# EAGLE design preamp (EAGLE 7.3.0)
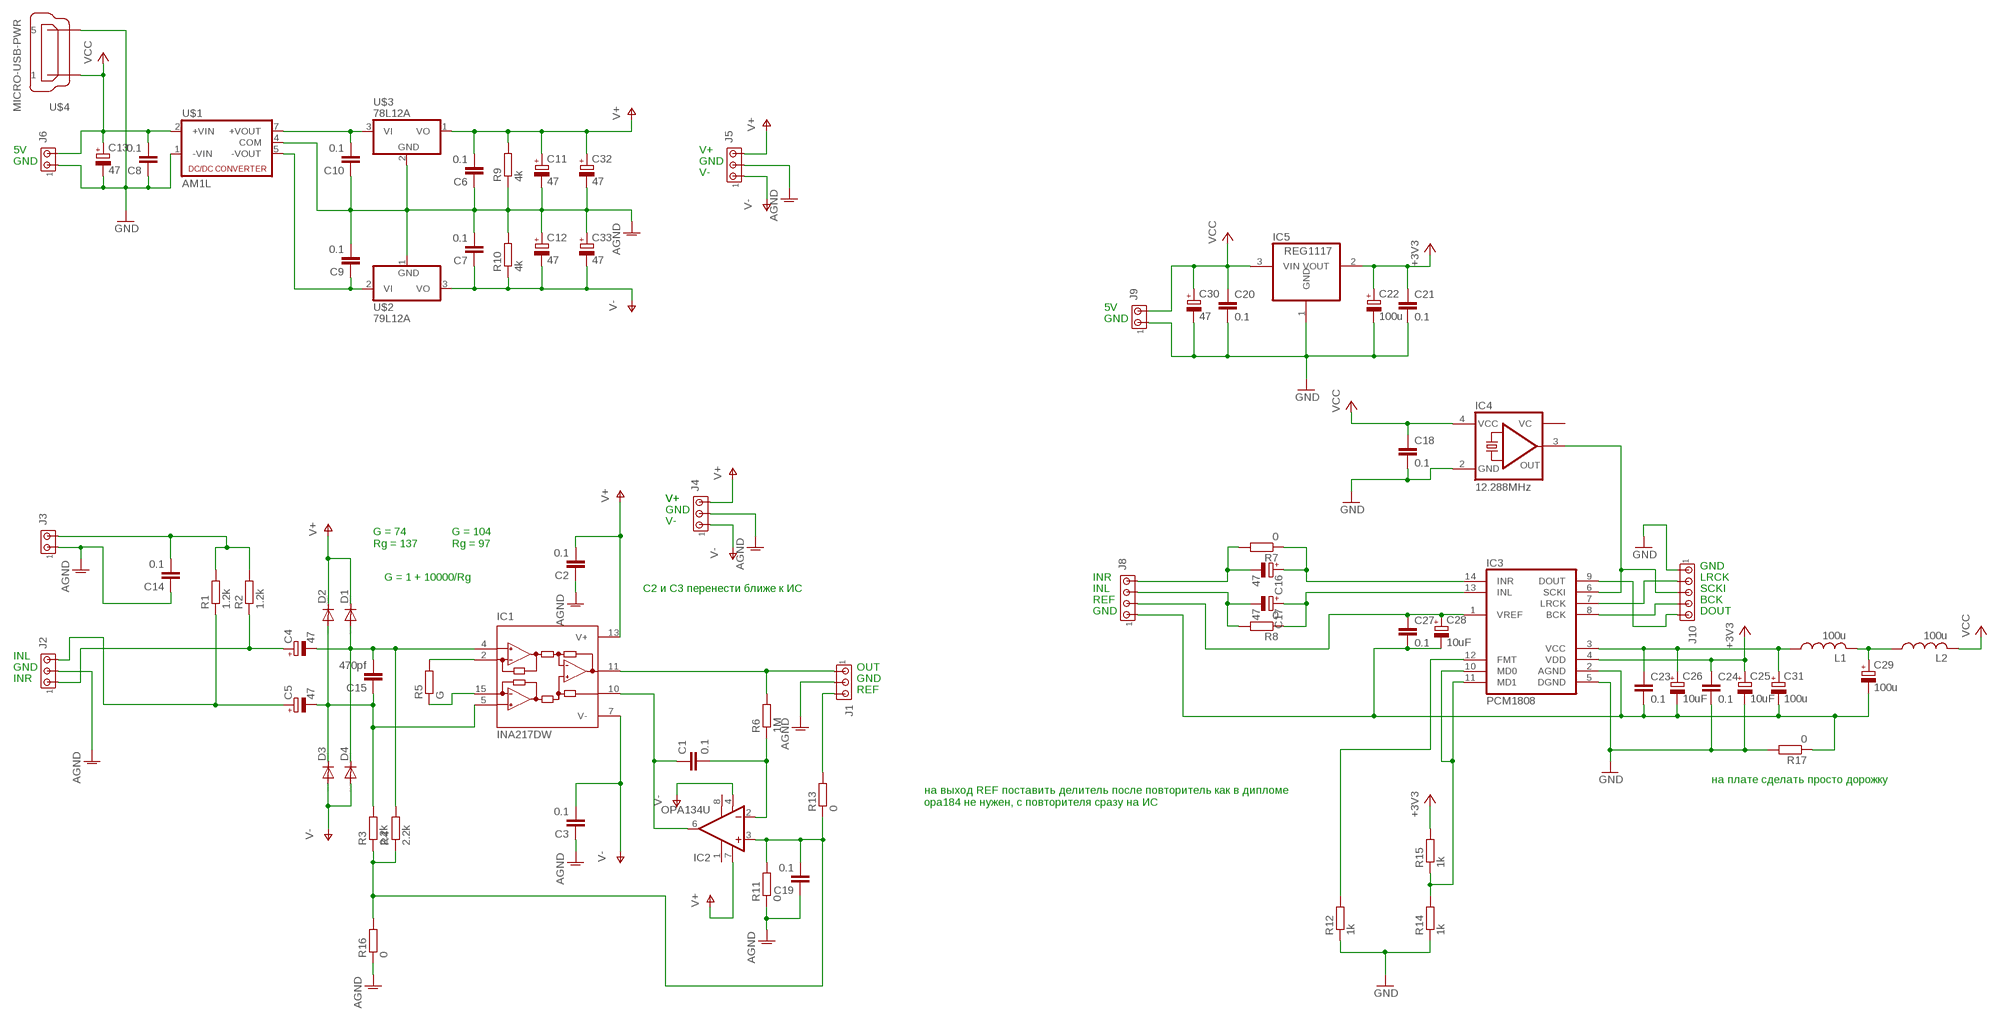
[diagram p0: schematic, sheet 1]

## Parts
C1  0.1  C-EUC0805  [C0805]
C2  0.1  C-EUC0805  [C0805]
C3  0.1  C-EUC0805  [C0805]
C4  47  CPOL-EU153CLV-0605  [153CLV-0605]
C5  47  CPOL-EU153CLV-0605  [153CLV-0605]
C6  0.1  C-EUC0805  [C0805]
C7  0.1  C-EUC0805  [C0805]
C8  0.1  C-EUC0805  [C0805]
C9  0.1  C-EUC0805  [C0805]
C10  0.1  C-EUC0805  [C0805]
C11  47  CPOL-EU153CLV-0605  [153CLV-0605]
C12  47  CPOL-EU153CLV-0605  [153CLV-0605]
C13  47  CPOL-EU153CLV-0605  [153CLV-0605]
C14  0.1  C-EUC0805  [C0805]
C15  470pf  C-EUC0805  [C0805]
C16  47  CPOL-EU153CLV-0605  [153CLV-0605]
C17  47  CPOL-EU153CLV-0605  [153CLV-0605]
C18  0.1  C-EUC0805  [C0805]
C19  0.1  C-EUC0805  [C0805]
C20  0.1  C-EUC0805  [C0805]
C21  0.1  C-EUC0805  [C0805]
C22  100u  CPOL-EU153CLV-0605  [153CLV-0605]
C23  0.1  C-EUC0805  [C0805]
C24  0.1  C-EUC0805  [C0805]
C25  10uF  CPOL-EUSMCA  [SMC_A]
C26  10uF  CPOL-EUSMCA  [SMC_A]
C27  0.1  C-EUC0805  [C0805]
C28  10uF  CPOL-EUSMCA  [SMC_A]
C29  100u  CPOL-EU153CLV-0605  [153CLV-0605]
C30  47  CPOL-EU153CLV-0605  [153CLV-0605]
C31  100u  CPOL-EU153CLV-0605  [153CLV-0605]
C32  47  CPOL-EU153CLV-0605  [153CLV-0605]
C33  47  CPOL-EU153CLV-0605  [153CLV-0605]
D1  DIODE-SOD123  [SOD123]
D2  DIODE-SOD123  [SOD123]
D3  DIODE-SOD123  [SOD123]
D4  DIODE-SOD123  [SOD123]
IC1  INA217DW  [DW_RPDSO-G16]
IC2  OPA134U  [SO08]
IC3  PCM1808  [TSSOP14]
IC4  12.288MHz  KXO-97  [KXO-97]
IC5  REG1117  [SOT223]
J1  MTA03-100  [10X03MTA]
J2  MTA03-100  [10X03MTA]
J3  MTA02-100  [10X02MTA]
J4  MTA03-100  [10X03MTA]
J5  MTA03-100  [10X03MTA]
J6  MTA02-100  [10X02MTA]
J8  MTA04-100  [10X04MTA]
J9  MTA02-100  [10X02MTA]
J10  MTA05-100  [10X05MTA]
L1  100u  L-USL3225M  [L3225M]
L2  100u  L-USL3225M  [L3225M]
R1  1.2k  R-EU_R0805  [R0805]
R2  1.2k  R-EU_R0805  [R0805]
R3  2.2k  R-EU_R0805  [R0805]
R4  2.2k  R-EU_R0805  [R0805]
R5  G  R-EU_R0805  [R0805]
R6  1M  R-EU_R0805  [R0805]
R7  0  R-EU_R0805  [R0805]
R8  0  R-EU_R0805  [R0805]
R9  4k  R-EU_R0805  [R0805]
R10  4k  R-EU_R0805  [R0805]
R11  0  R-EU_R0805  [R0805]
R12  1k  R-EU_R0805  [R0805]
R13  0  R-EU_R0805  [R0805]
R14  1k  R-EU_R0805  [R0805]
R15  1k  R-EU_R0805  [R0805]
R16  0  R-EU_R0805  [R0805]
R17  0  R-EU_R0805  [R0805]
U$1  AM1L  [SO20]
U$2  79L12A  [SOT89]
U$3  78L12A  [SOT89]
U$4  MICRO-USB-PWR  [MICRO-USB]

## Nets
+3V3: C21.1 C22.+ C24.1 C25.+ IC3.4(VDD) IC5.2(VOUT) R15.2
AGND: C2.1 C3.1 C6.1 C7.2 C9.2 C10.1 C11.- C12.+ C14.1 C19.1 C32.- C33.+ J1.2 J2.2 J3.1 J4.2 J5.2 R9.1 R10.2 R11.1 R16.1 U$1.4(COM) U$2.1(GND) U$3.2(GND)
AGND2: C23.2 C26.- C27.2 C28.- C29.- C31.- IC3.2(AGND) J8.1 R17.1
GND: C8.1 C13.- C18.2 C20.2 C21.2 C22.- C24.2 C25.- C30.- IC3.5(DGND) IC4.2(GND) IC5.1(GND) J6.1 J9.1 J10.1 R12.1 R14.1 R17.2 U$1.1(-VIN) U$4.5
N$1: IC1.2(RG1) R5.2
N$2: IC1.15(RG2) R5.1
N$3: C5.- C15.1 D2.A D3.C IC1.5(+IN) R3.2
N$4: C4.- C15.2 D1.A D4.C IC1.4(-IN) R4.2
N$5: C4.+ J2.1 R2.1
N$6: C5.+ J2.3 R1.1
N$7: C10.2 U$1.7(+VOUT) U$3.3(VI)
N$8: IC3.6(SCKI) IC4.3(OUT) J10.3
N$9: IC3.9(DOUT) J10.5
N$10: C29.+ L1.2 L2.1
N$11: C14.2 J3.2 R1.2 R2.2
N$12: C1.2 IC2.2(-IN) R6.1
N$13: IC1.11(OUT) J1.1 R6.2
N$14: C1.1 IC1.10(REF) IC2.6(OUT)
N$16: C9.1 U$1.5(-VOUT) U$2.2(VI)
N$17: IC3.12(FMT) R12.2
N$18: IC3.7(LRCK) J10.2
N$19: IC3.8(BCK) J10.4
N$20: C27.1 C28.+ IC3.1(VREF) J8.2
N$22: C16.- J8.4 R7.2
N$23: C17.- J8.3 R8.2
N$24: C17.+ IC3.13(INL) R8.1
N$25: C16.+ IC3.14(INR) R7.1
N$26: IC3.10(MD0) IC3.11(MD1) R14.2 R15.1
N$27: C23.1 C26.+ C31.+ IC3.3(VCC) L1.1
N$28: J1.3 R13.2
N$29: C19.2 IC2.3(+IN) R3.1 R4.1 R11.2 R13.1 R16.2
V+: C2.2 C6.2 C11.+ C32.+ D1.C D2.C IC1.13(V+) IC2.7(V+) J4.3 J5.3 R9.2 U$3.1(VO)
V-: C3.2 C7.1 C12.- C33.- D3.A D4.A IC1.7(V-) IC2.4(V-) J4.1 J5.1 R10.1 U$2.3(VO)
VCC: C8.2 C13.+ C18.1 C20.1 C30.+ IC4.4(VCC) IC5.3(VIN) J6.2 J9.2 L2.2 U$1.2(+VIN) U$4.1
Unconnected: IC2.1(TRIM1) IC2.8(TRIM2) IC4.1(VC)

## Notes on the sheet
- 5V | V+
- GND | GND
- V-
- 5V
- GND
- V+ | V+
- GND
- V-
- G = 74
  Rg = 137
- G = 104
  Rg = 97
- GND
- G = 1 + 10000/Rg | INR | LRCK
- С2 и С3 перенести ближе к ИС | INL | SCKI
- REF | BCK
- GND | DOUT
- INL
- GND | OUT
- INR | GND
- REF
- на плате сделать просто дорожку
- на выход REF поставить делитель после повторитель как в дипломе
  opa184 не нужен, с повторителя сразу на ИС

## Library data of the parts
C1-C3 C6-C10 C14 C15 C18-C21 C23 C24 C27 = rcl:C-EU: CAPACITOR, European symbol
C4 C5 C11-C13 C16 C17 C22 C25 C26 C28-C33 = rcl:CPOL-EU: POLARIZED CAPACITOR, European symbol
D1-D4 = diode:DIODE-: DIODE
IC1 = burr-brown:INA217: Low-Noise, Low-Distortion INSTRUMENTATION AMPLIFIER Replacement for SSM2017 Source: http://focus.ti.com/lit/ds/symlink/ina217.pdf; MF: TEXAS INSTRUMENTS; MPN: INA217AIDWT; OC_FARNELL: 1459470; OC_NEWARK: 02E2758
IC2 = burr-brown:OPA134: Operational Amplifiers SoundPlus(TM) High Performance Audio; MF: TEXAS INSTRUMENTS; MPN: OPA134UA; OC_FARNELL: 1097514; OC_NEWARK: 80K6009
IC3 = rpiadc:PCM1808
IC4 = rpiadc:KXO-97
IC5 = burr-brown:REG1117: 800mA and 1A Low Dropout (LDO) Positive Regulator 1.8V, 2.5V, 2.85V, 3.3V, 5V, and Adj; MPN: REG1117; OC_FARNELL: 1097566; OC_NEWARK: 14P6981
J1 J2 J4 J5 = con-amp:MTA03-100: AMP connector
J3 J6 J9 = con-amp:MTA02-100: AMP connector
J8 = con-amp:MTA04-100: AMP connector
J10 = con-amp:MTA05-100: AMP connector
L1 L2 = rcl:L-US: INDUCTOR, American symbol
R1-R17 = rcl:R-EU_: RESISTOR, European symbol
U$1 = rpiadc:AM1L
U$2 = rpiadc:79L12A
U$3 = rpiadc:78L12A
U$4 = rpiadc:MICRO-USB-PWR

## Board
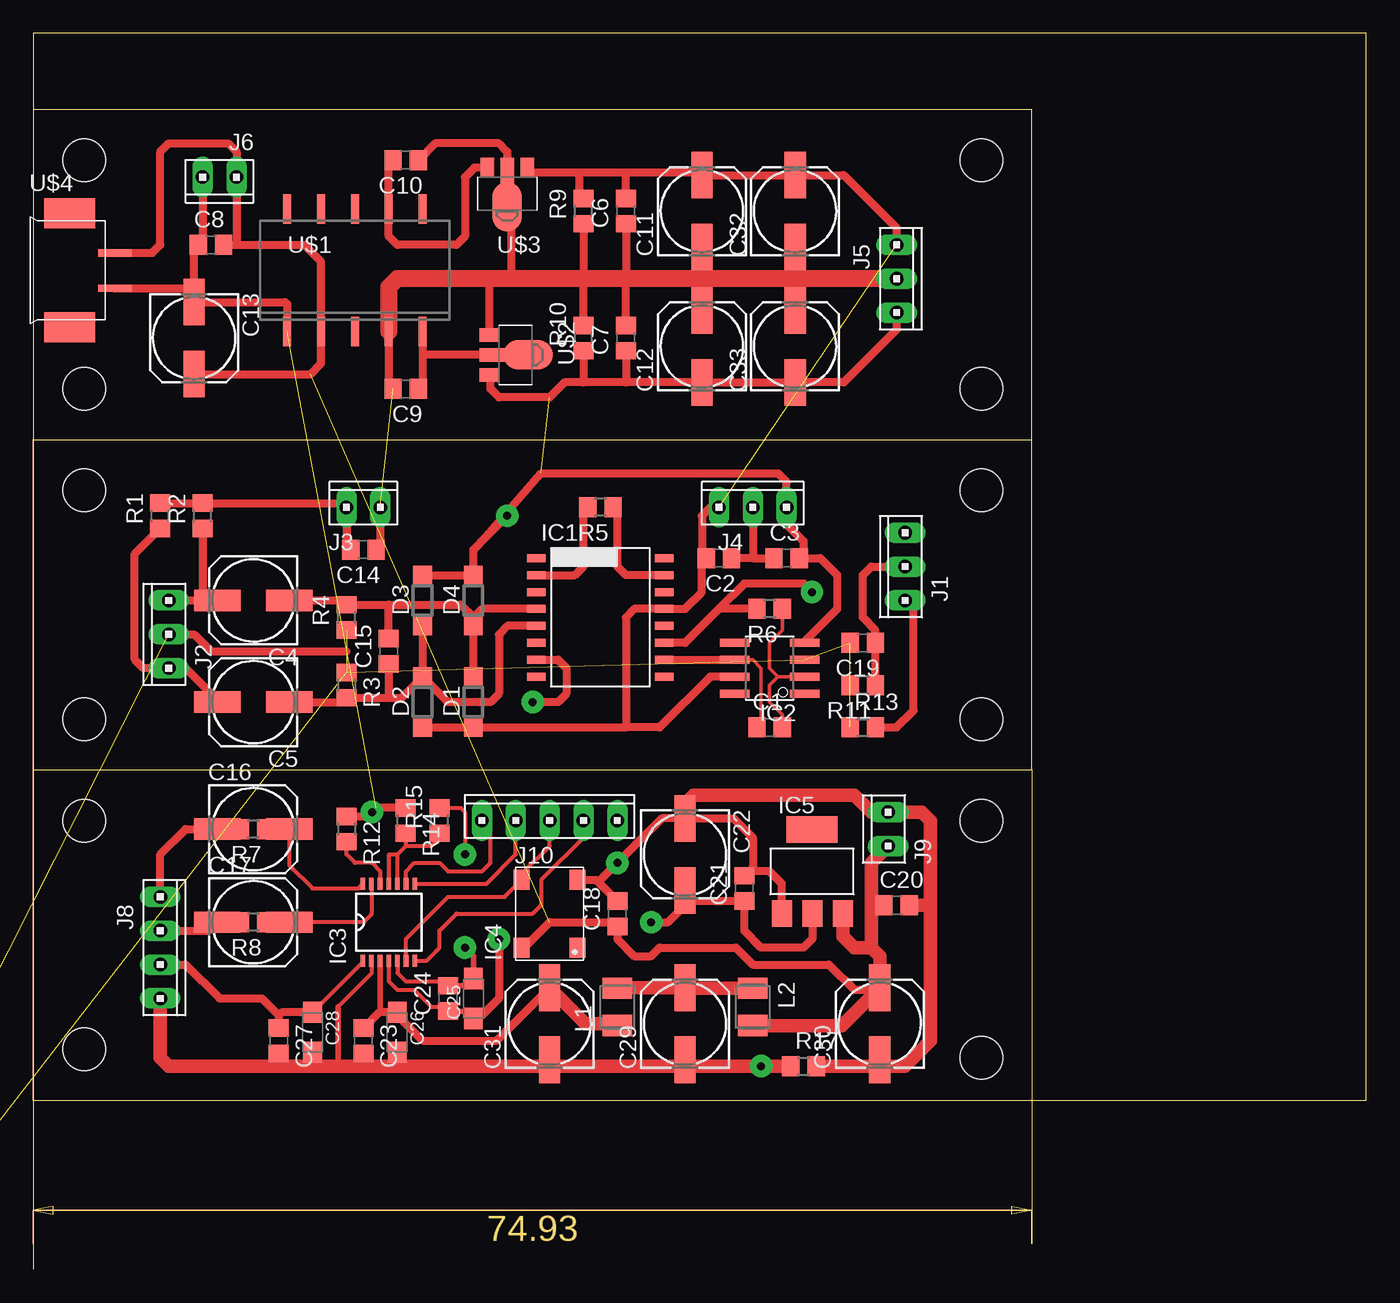
[diagram p1: board, top side]
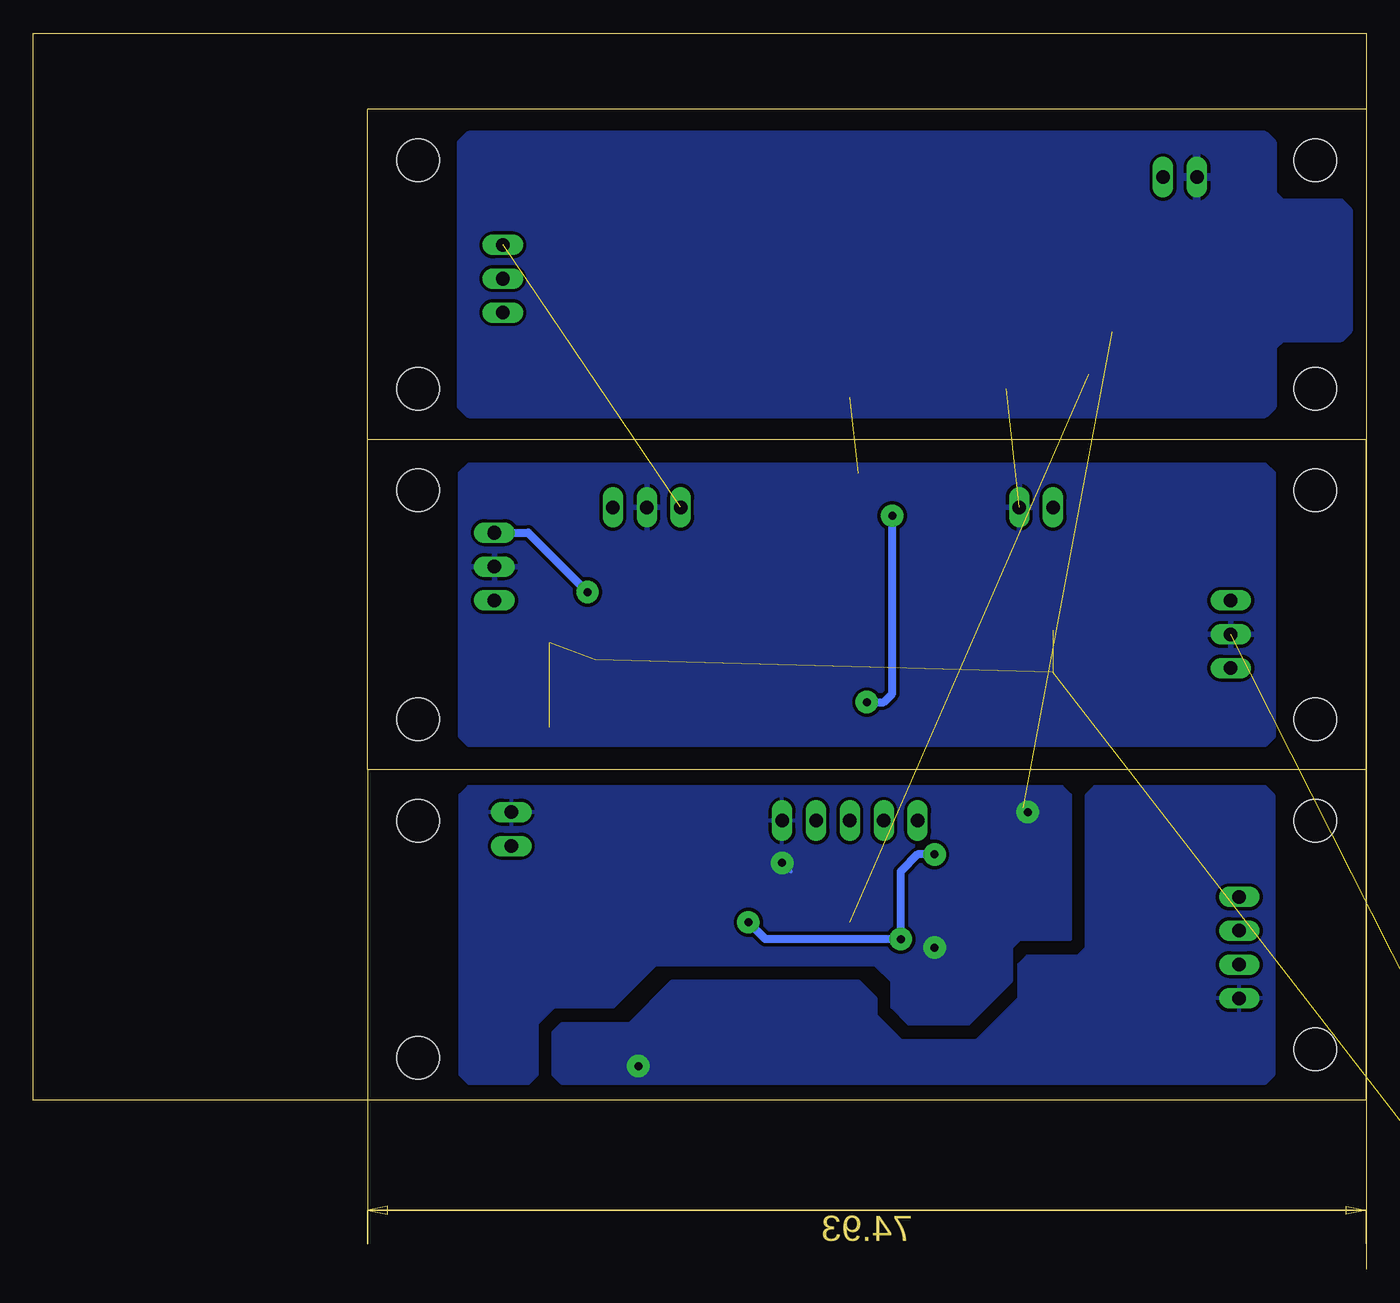
[diagram p2: board, bottom side, seen from below]

Size 100 x 92.7 mm. Coordinates in mm from the lower left corner, seen from the top.
Outline: 0,12.7 100,12.7 100,92.7 0,92.7 0,87
Outline: 0,87 0,62.23
Outline: 0,62.23 0,37.47
Outline: 0,37.47 0,12.7
Outline: 0,37.47 74.93,37.47
Outline: 74.93,37.47 74.93,1.9
Outline: 74.93,37.47 74.93,62.23
Outline: 74.93,62.23 74.93,87 0,87
Outline: 0,62.23 74.93,62.23
Outline: 0,12.7 0,0
Copper layers (1*16): Top 0.035mm / dielectric 1.5mm / Bottom 0.035mm
Design rules "default *": minimum track width 8mil, minimum drill 12mil, track to track 10mil, track to pad 10mil, pad to pad 10mil, via to via 10mil, smd to smd 10mil, copper to edge 40mil, drill to drill 8mil, minimum pad ring 10mil, minimum via ring 8mil, stop-mask expansion 4mil, vias tented up to drill 0mil, thermal gap 10mil
Holes 3.2 mm at 3.81,33.66 3.81,16.51 71.12,15.88 71.12,33.66 3.81,41.27 3.81,58.42 71.12,41.27 71.12,58.42 3.81,66.04 71.12,66.04 3.81,83.19 71.12,83.19

### Footprints (pad centres in the part's own frame; a part is rotated, then mirrored left to right if it is on the bottom)
C0805 = smd 1.3 x 1.5: 1 -0.95,0; 2 0.95,0
153CLV-0605 = smd 3.5 x 1.6: + 2.7,0; - -2.7,0
SMC_A = smd 1.6 x 1.4: + -1.5,0; - 1.5,0
SOD123 = smd 1.4 x 1.4: A 1.9,0; C -1.9,0
DW_RPDSO-G16 = smd 0.6 x 1.4: 1 -4.445,-4.8; 2 -3.175,-4.8; 3 -1.905,-4.8; 4 -0.635,-4.8; 5 0.635,-4.8; 6 1.905,-4.8; 7 3.175,-4.8; 8 4.445,-4.8; 9 4.445,4.8; 10 3.175,4.8; 11 1.905,4.8; 12 0.635,4.8; 13 -0.635,4.8; 14 -1.905,4.8; 15 -3.175,4.8; 16 -4.445,4.8
SO08 = smd 0.61 x 2.21: 1 -1.905,-2.616; 2 -0.635,-2.616; 3 0.635,-2.616; 4 1.905,-2.616; 5 1.905,2.616; 6 0.635,2.616; 7 -0.635,2.616; 8 -1.905,2.616
TSSOP14 = smd 0.9 x 0.35: 1 -2.875,1.95; 2 -2.875,1.3; 3 -2.875,0.65; 4 -2.875,0; 5 -2.875,-0.65; 6 -2.875,-1.3; 7 -2.875,-1.95; 8 2.875,-1.95; 9 2.875,-1.3; 10 2.875,-0.65; 11 2.875,0; 12 2.875,0.65; 13 2.875,1.3; 14 2.875,1.95
KXO-97 = smd 1.5 x 1.2: 1 -2.54,-2.1; 2 2.54,-2.1; 3 2.54,2.1; 4 -2.54,2.1
SOT223 = smd 1.499 x 2.007: 1 -2.261,-3.15; 2 0.025,-3.15; 3 2.311,-3.15 | smd 3.81 x 2.007: 4 0,3.15
10X03MTA = drill 1.016 long: 1 2.54,0; 2 0,0; 3 -2.54,0
10X02MTA = drill 1.016 long: 1 1.27,0; 2 -1.27,0
10X04MTA = drill 1.016 long: 1 3.81,0; 2 1.27,0; 3 -1.27,0; 4 -3.81,0
10X05MTA = drill 1.016 long: 1 5.08,0; 2 2.54,0; 3 0,0; 4 -2.54,0; 5 -5.08,0
L3225M = smd 1.6 x 2.2: 1 -1.4,0; 2 1.4,0
R0805 = smd 1.3 x 1.5: 1 -0.95,0; 2 0.95,0
SO20 = smd 0.6 x 2.2: 1 -5.715,-4.6; 2 -3.175,-4.6; 3 -0.635,-4.6; 4 1.905,-4.6; 5 4.445,-4.6; 6 4.445,4.6; 7 1.905,4.6; 8 -0.635,4.6; 9 -3.175,4.6; 10 -5.715,4.6
SOT89 = smd 1 x 1.5: 1 -1.499,-1.981; 3 1.499,-1.981 | smd 1 x 2: 2 0,-1.727 | smd 2.2 x 3.7: 2@1 0,0.94
MICRO-USB = smd 2.5 x 0.55: 1 2.95,1.3; 5 2.95,-1.35 | smd 3.8 x 2.25: M1 -0.45,4.275; M2 -0.45,-4.275

### Placement (x,y rotation side)
C1  55.24,40.64 0 top
C2  51.44,53.34 180 top
C3  56.52,53.34 0 top
C4  16.51,50.17 180 top
C5  16.51,42.55 180 top
C6  44.45,79.38 90 top
C7  44.45,69.85 90 top
C8  13.34,76.84 0 top
C9  27.94,66.04 180 top
C10  27.94,83.19 180 top
C11  50.16,79.38 90 top
C12  50.16,69.22 90 top
C13  12.06,69.85 270 top
C14  24.77,53.97 180 top
C15  26.67,46.36 90 top
C16  16.51,33.02 0 top
C17  16.51,26.04 0 top
C18  43.81,26.67 90 top
C19  62.23,46.99 180 top
C20  64.77,27.3 0 top
C21  53.34,28.57 90 top
C22  48.9,31.11 270 top
C23  24.77,17.14 270 top
C24  31.11,20.32 90 top
C25  33.02,20.32 90 top
C26  27.3,17.78 270 top
C27  18.41,17.14 270 top
C28  20.95,17.78 270 top
C29  48.9,18.41 90 top
C30  63.5,18.41 90 top
C31  38.73,18.41 90 top
C32  57.15,79.38 90 top
C33  57.15,69.22 90 top
D1  33.02,42.55 90 top
D2  29.21,42.55 90 top
D3  29.21,50.17 90 top
D4  33.02,50.17 90 top
IC1  42.55,48.89 270 top
IC2  55.24,45.08 90 top
IC3  26.67,26.04 90 top
IC4  38.73,26.67 90 top
IC5  58.42,29.84 0 top
J1  65.41,52.7 90 top
J2  10.16,47.62 90 top
J3  24.77,57.15 0 top
J4  53.98,57.15 0 top
J5  64.77,74.3 270 top
J6  13.97,81.92 180 top
J8  9.53,24.13 270 top
J9  64.14,33.02 90 top
J10  38.73,33.66 0 top
L1  43.81,19.68 90 top
L2  53.98,19.68 270 top
R1  9.53,56.52 90 top
R2  12.7,56.52 90 top
R3  23.5,43.81 270 top
R4  23.5,48.89 90 top
R5  42.55,57.15 180 top
R6  55.24,49.53 180 top
R7  16.51,33.02 180 top
R8  16.51,26.04 180 top
R9  41.27,79.38 90 top
R10  41.27,69.85 90 top
R11  62.23,43.81 180 top
R12  23.5,33.02 270 top
R13  62.23,40.64 0 top
R14  27.94,33.66 270 top
R15  30.48,33.66 90 top
R16  -14.61,-3.18 0 top  (outside the outline)
R17  57.78,15.24 0 top
U$1  24.77,74.93 0 top
U$2  36.2,68.58 270 top
U$3  35.56,80.64 180 top
U$4  3.17,74.93 0 top

### Tracks (layer width: path | path; a pad name or v marks a point on that pad's centre or on a via)
+3V3  (via drill 0.6 pad 1.68)
  Top 0.305: IC3.4 26.67,21.59 27.3,20.95 28.57,20.95 29.84,19.68 30.8,19.68 | IC5.2 58.45,25.42 | 49.69,27.62 C22.+ | C22.+ 48.9,27.94 49.21,27.62 | R15.2 32.07,34.61 32.38,34.29 v32.38,31.11 | C22.+ 48.9,28.57
  Top 0.406: 30.8,19.68 C24.1 32.47,19.37 C25.+ 33.25,19.05 33.66,19.05
  Top 0.61: IC5.2 58.45,24.79 57.78,24.13 54.61,24.13 53.34,25.4 C21.1 49.21,27.62 47.62,26.04 v46.35,26.04 | v34.92,24.77 34.92,20.32 33.66,19.05
  Bottom 0.61: v46.35,26.04 45.09,24.77 v34.92,24.77 34.92,29.84 33.66,31.11 v32.38,31.11
AGND  (2 unrouted)
  Top 0.406: 26.04,54.3 C14.1
  Top 0.61: 53.98,53.34 C3.1 | 23.5,46.36 13.34,46.36 12.06,47.62 J2.2 | J1.2 62.87,52.7 62.23,52.07 62.23,48.89 63.18,47.94 C19.1 R11.1 | J3.1 26.04,54.3 | J4.2 53.98,53.34 | 53.98,53.34 C2.1 | U$1.4 26.67,66.36 C9.2 | 34.21,71.04 U$2.1 34.21,74.22 34.29,74.3 | 50.01,76.84 C11.- 50.16,74.3 C12.+ | C33.+ 57.15,74.3 C32.- | R10.2 41.27,74.3 R9.1 | C7.2 44.45,74.3 C6.1 | 35.56,74.3 35.88,74.61 35.88,80.33 35.56,80.64 U$3.2 35.56,83.82 34.92,84.45 30.16,84.45 C10.1
  Top 1.27: U$1.4 26.67,73.66 27.3,74.3 34.29,74.3 35.56,74.3 41.27,74.3 44.45,74.3 50.16,74.3 57.15,74.3 J5.2
  pour Bottom: 6.99,59.69 6.99,40 7.62,39.37 67.31,39.37 67.94,40 67.94,59.69 67.31,60.33 7.62,60.33
AGND2  (via drill 0.6 pad 1.68)
  Top 0.305: 25.4,23.16 IC3.2 25.37,22.2 22.86,19.68 | C27.2 18.41,15.24 | C28.- 20.95,15.24 | C23.2 24.77,15.24 | C26.- 27.3,15.24 | C31.- 38.73,15.24 | C29.- 48.9,15.24
  Top 0.406: 22.86,19.68 22.86,15.24
  Top 1.016: J8.1 9.53,15.88 10.16,15.24 18.41,15.24 20.95,15.24 22.86,15.24 24.77,15.24 27.3,15.24 38.73,15.24 48.9,15.24 v54.61,15.24 R17.1
  pour Bottom: 20.95,24.13 20.95,35.56 20.32,36.2 7.62,36.2 6.99,35.56 6.99,14.6 7.62,13.97 60.33,13.97 60.96,14.6 60.96,17.78 60.33,18.41 55.24,18.41 52.07,21.59 38.1,21.59 36.83,20.32 36.83,19.05 34.92,17.14 29.21,17.14 26.04,20.32 26.04,22.86 25.4,23.49 21.59,23.49
GND  (via drill 0.6 pad 1.68)  (1 unrouted)
  Top 0.305: IC3.5 27.32,22.21 27.94,21.59 30.8,21.59 | 32.47,21.27 C25.- | 63.02,15.24 C30.- | 53.98,30.16 C21.2
  Top 0.406: 30.8,21.59 C24.2 32.47,21.27 | 42.23,29.21 42.55,29.21 | C25.- 33.02,23.49 v32.38,24.13
  Top 0.61: IC4.2 42.23,29.21 C18.2 | 53.98,30.16 53.98,32.38 52.55,33.81 C22.- 47.15,33.81 v43.81,30.48 42.55,29.21 | R14.1 25.71,34.61 v25.4,34.29 25.08,33.97 R12.1 | IC5.1 56.16,28.93 55.24,29.84 53.66,29.84 C21.2 | 19.05,71.12 U$1.1 19.05,72.39 18.89,72.55 C13.- | 11.67,72.94 C13.- | C13.- 12.06,73.66 | 12.06,73.66 12.06,76.52 C8.1 12.7,77.15 J6.1 | U$4.5 11.98,73.58 12.06,73.66
  Top 1.016: R17.2 63.5,15.24 | 63.5,15.24 65.41,15.24 67.31,17.14 67.31,27.3 | 67.31,27.3 67.31,33.66 66.67,34.29 J9.1 62.87,34.29 61.59,35.56 49.53,35.56 48.9,34.92 48.9,33.66 | C20.2 67.31,27.3 | C30.- 63.5,15.24
  Bottom 0.305: 43.18,29.84 v43.81,30.48
  pour Bottom: 22.23,35.56 22.23,24.77 26.04,24.77 26.67,24.13 26.67,21.59 29.84,18.41 34.29,18.41 35.56,19.68 35.56,21.59 36.83,22.86 53.34,22.86 56.52,19.68 67.94,19.68 67.94,35.56 67.31,36.2 22.86,36.2
  pour Bottom: 6.99,64.77 6.99,69.22 6.35,69.85 1.91,69.85 1.27,70.48 1.27,79.38 1.91,80.01 6.35,80.01 6.99,80.64 6.99,84.45 7.62,85.09 67.31,85.09 67.94,84.45 67.94,64.77 67.31,64.14 7.62,64.14
N$1
  Top 0.254: 41.27,56.83 R5.2
  Top 0.61: IC1.2 40.64,52.07 41.27,52.7 41.27,56.83
N$2
  Top 0.254: 43.81,56.83 R5.1
  Top 0.61: IC1.15 44.45,52.07 43.81,52.7 43.81,56.83
N$3
  Top 0.406: 23.5,42.55 R3.2
  Top 0.61: R3.2 26.67,42.86 | 26.67,42.86 27.63,42.86 D2.A | D3.C D2.A | C15.1 26.67,42.86 | C5.- 23.5,42.55 | D2.A 31.11,42.55 34.29,42.55 34.92,43.18 34.92,47.62 35.56,48.26 IC1.5
N$4
  Top 0.254: 33.02,48.89 D4.C
  Top 0.406: 23.5,50.17 R4.2
  Top 0.61: R4.2 26.67,49.84 | 26.67,49.84 32.07,49.84 33.02,48.89 33.66,49.53 IC1.4 | C15.2 26.67,49.84 | D1.A D4.C | C4.- 23.5,50.17
N$5
  Top 0.406: 12.7,50.17 C4.+
  Top 0.61: J2.1 12.7,50.17 R2.1
N$6
  Top 0.61: C5.+ 13.34,43.02 13.34,43.18 11.43,45.08 J2.3 8.26,45.08 7.62,45.72 7.62,53.66 R1.1
N$7
  Top 0.61: U$3.3 33.1,82.63 32.38,81.92 32.38,77.47 31.75,76.84 27.3,76.84 26.67,77.47 U$1.7 26.67,82.87 C10.2
N$8
  Top 0.305: IC3.6 27.97,24.8 31.11,27.94 35.37,27.94 IC4.3 | IC4.3 36.63,29.65 | IC4.3 36.83,29.4 36.83,29.84 38.73,31.75 J10.3
N$9
  Top 0.305: IC3.9 27.97,29.88 28.57,30.48 30.48,30.48 31.11,29.84 33.66,29.84 34.29,30.48 34.29,33.02 J10.5
N$10
  Top 0.305: C29.+ 49.53,21.11 49.5,21.09
  Top 1.016: L2.1 48.92,21.09 C29.+ 43.84,21.11 L1.2
N$11
  Top 0.406: 23.5,54.3 C14.2
  Top 0.61: R1.2 R2.2 23.18,57.47 J3.2 23.5,54.3
N$12
  Top 0.254: IC2.2 55.88,44.45 | 55.88,44.45 55.24,43.81 55.24,42.55 56.2,41.59 C1.2 | R6.1 56.2,47.94 55.24,46.99 55.24,45.08 55.88,44.45
N$13  (via drill 0.6 pad 1.68)
  Top 0.61: 51.44,49.53 53.34,51.44 57.78,51.44 v58.42,50.8 | IC1.11 48.9,46.99 51.44,49.53 | R6.2 51.44,49.53
  Bottom 0.61: J1.1 62.87,55.25 v58.42,50.8
N$14
  Top 0.254: 54.61,40.32 54.61,40.64 | 54.61,40.64 54.61,45.08 53.98,45.72 IC2.6 | C1.1 54.61,40.64
  Top 0.61: IC1.10 IC2.6
N$16
  Top 0.61: U$1.5 29.21,68.58 | U$2.2 29.21,68.58 | 29.21,68.58 29.21,66.36 C9.1
N$17
  Top 0.305: IC3.12 26.04,28.93 26.04,29.84 25.4,30.48 24.13,30.48 23.5,31.11 R12.2
N$18
  Top 0.305: J10.2 41.27,32.38 38.1,29.21 38.1,27.3 37.47,26.67 31.75,26.67 30.48,25.4 30.48,24.13 29.51,23.16 IC3.7
N$19
  Top 0.305: J10.4 36.2,31.11 33.99,28.91 IC3.8
N$20
  Top 0.305: IC3.1 24.72,23.05 C28.+
  Top 0.61: J8.2 11.43,22.86 13.97,20.32 17.14,20.32 18.41,19.05 | C28.+ 18.64,19.28 18.41,19.05 | 18.41,19.05 C27.1
N$21
  pour Bottom: 60.96,19.68 62.23,18.41 62.23,14.6 62.87,13.97 67.31,13.97 67.94,14.6 67.94,19.68
N$22
  Top 0.406: C16.- 13.97,32.86 14.61,32.86 | 14.61,32.86 15.4,32.86 R7.2 | 14.45,33.02 14.61,32.86
  Top 0.61: J8.4 9.53,31.11 11.43,33.02 14.45,33.02
N$23
  Top 0.406: 13.18,25.4 C17.- R8.2
  Top 0.61: J8.3 13.18,25.4
N$24
  Top 0.305: IC3.13 25.37,26.64 24.77,26.04 C17.+
  Top 0.406: C17.+ R8.1
N$25
  Top 0.305: IC3.14 24.39,28.57 20.95,28.57 19.21,30.32 C16.+
  Top 0.406: R7.1 C16.+
N$26
  Top 0.305: IC3.11 26.67,31.11 27.3,31.11 27.32,31.13 | IC3.10 27.32,31.13 | R14.2 27.94,31.75 | 27.94,31.75 27.32,31.13 | R15.1 30.48,32.38 29.84,31.75 27.94,31.75
N$27
  Top 0.305: 26.04,19.36 25.95,19.28 | C26.+ 27.3,19.05 | C31.+ 38.73,20.95 | 43.69,18.41 L1.1
  Top 0.406: IC3.3 26.02,19.38 26.04,19.36
  Top 0.61: C23.1 25.95,19.28 C26.+ | 27.3,19.05 29.21,17.14 34.77,17.14 C31.+
  Top 1.016: 43.69,18.41 41.44,18.41 C31.+
N$28
  Top 0.61: R13.2 64.77,40.64 66.04,41.91 66.04,49.53 J1.3
N$29  (6 unrouted)
V+  (1 unrouted)
  Top 0.254: 50.8,53.02 C2.2 | 44.45,40.64
  Top 0.61: D2.C D1.C 44.45,40.64 | IC2.7 50.8,44.45 46.99,40.64 44.45,40.64 44.45,48.89 45.09,49.53 IC1.13 48.9,49.53 50.16,50.8 50.16,53.02 C2.2 50.16,53.66 50.16,56.52 50.8,57.15 J4.3 | 44.45,82.23 50.01,82.23 C11.+ C32.+ 60.8,82.08 64.77,78.11 J5.3 | 44.45,82.23 40.96,82.23 | 40.96,82.23 40.96,80.64 R9.2 | C6.2 44.45,82.23 | 40.96,82.23 37.45,82.23 U$3.1
V-  (via drill 0.6 pad 1.68)  (1 unrouted)
  Top 0.254: 57.78,53.66 C3.2 | IC2.4 57.86,47.07
  Top 0.61: D3.A D4.A 33.02,53.97 33.97,54.93 | 33.97,54.93 38.1,59.69 55.88,59.69 56.52,59.05 J4.1 56.52,55.88 57.78,54.61 57.78,53.66 | C3.2 59.05,53.34 60.33,52.07 60.33,49.53 57.86,47.07 | IC1.7 39.37,45.72 40.01,45.08 40.01,43.18 39.37,42.55 v37.47,42.55 | v35.56,56.52 33.97,54.93 | J5.1 64.77,70.48 60.8,66.52 C33.- C12.- 44.45,66.52 | U$2.3 34.29,67 34.29,66.04 34.92,65.41 38.73,65.41 39.84,66.52 41.27,66.52 | 44.45,66.52 41.27,66.52 | R10.1 41.27,66.52 | C7.1 44.45,66.52
  Bottom 0.61: v37.47,42.55 36.2,42.55 35.56,43.18 v35.56,56.52
VCC  (1 unrouted)
  Top 0.305: IC4.4 36.83,24.13 | 64.14,27.62 C20.1 | C30.+ 63.5,20.95 63.82,21.27 63.82,21.43 63.66,21.43 63.5,21.59 C30.+ | 63.34,20.95 C30.+
  Top 0.406: 43.5,26.04 C18.1
  Top 0.61: 36.83,24.13 38.73,26.04 43.5,26.04 | C18.1 43.81,24.77 45.09,23.49 46.35,23.49 46.99,24.13 52.7,24.13 53.98,22.86 59.69,22.86 61.59,20.95 63.34,20.95 | C13.+ 20.8,67.15 21.59,67.94 U$1.2 21.59,75.56 20.32,76.84 15.24,76.84 | 15.24,76.84 J6.2 15.24,83.82 14.61,84.45 10.16,84.45 9.53,83.82 9.53,76.84 8.92,76.23 U$4.1 | C8.2 15.24,76.84
  Top 1.016: 63.82,21.43 C30.+ | J9.2 62.87,30.48 62.87,27.3 | 62.87,27.3 62.87,24.13 | C20.1 62.87,27.3 | IC5.3 60.73,24.99 61.59,24.13 62.87,24.13 | C30.+ 63.5,23.49 62.87,24.13 | L2.2 60.67,18.29 C30.+